# Altium schematic sheet [00] - COVER PAGE.SchDoc
size A3; DocumentNumber: 2; SheetNumber: 2; SheetTotal: 5
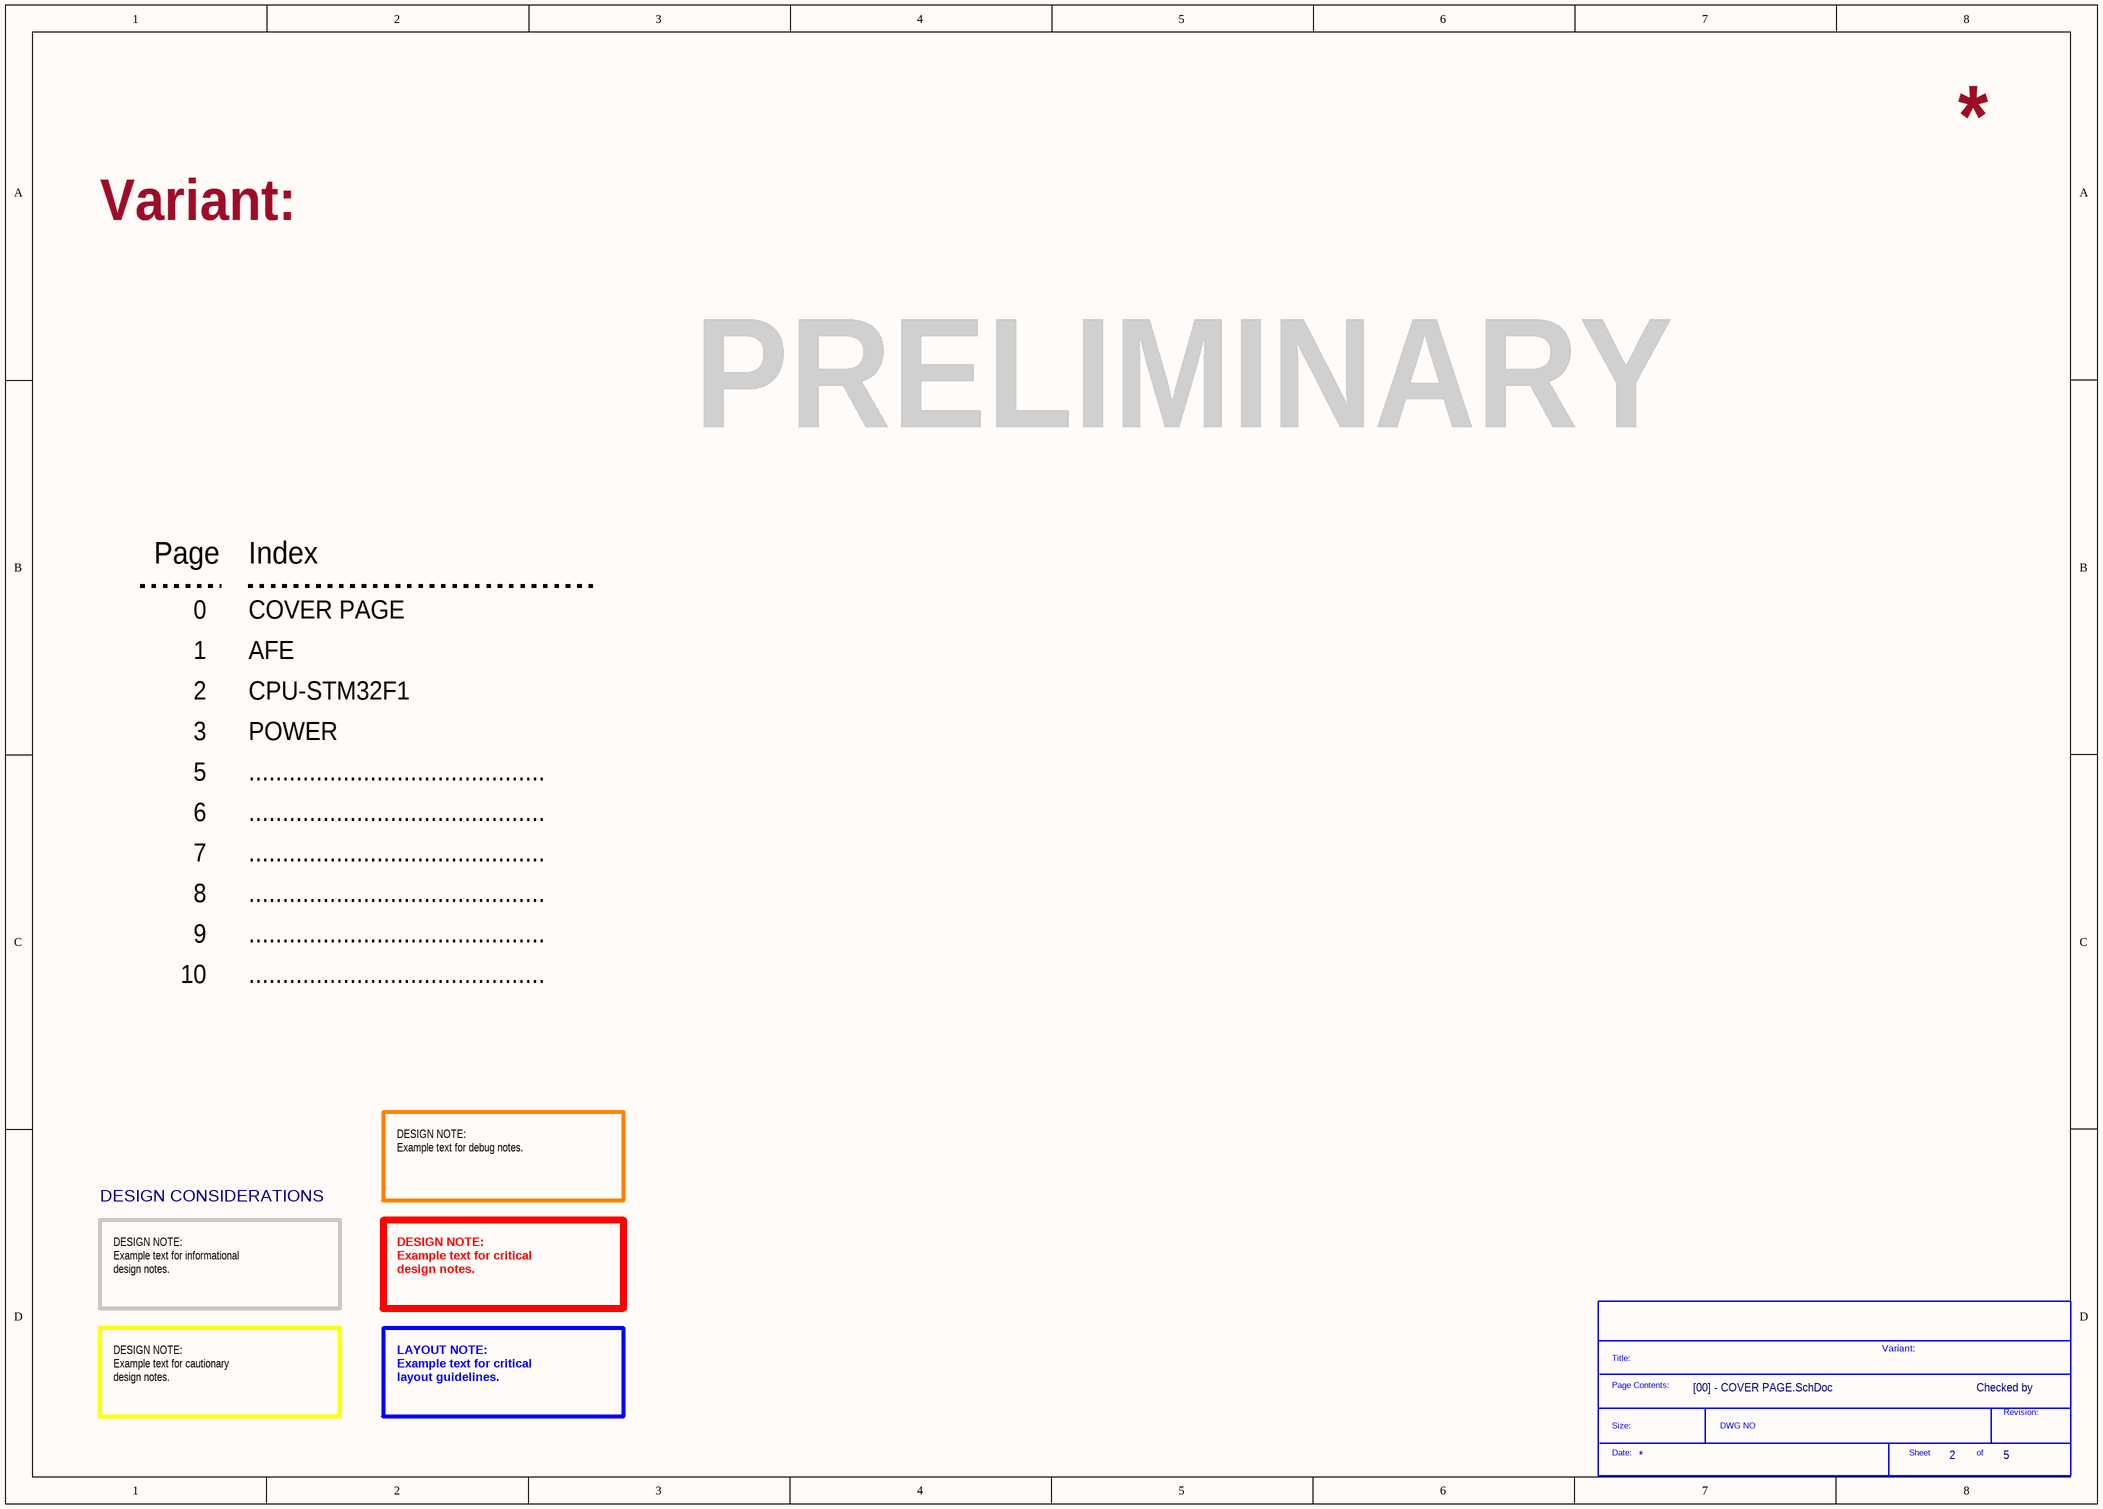
[diagram p0: [00] - COVER PAGE.SchDoc]

## Parts
*  SDTitleBlock  (value not drawn)  (graphical)

## Notes on the sheet
- Variant:
- PRELIMINARY
- Page
- Index
- 0
- COVER PAGE
- 1
- 2
- AFE
- CPU-STM32F1
- 3
- 5
- POWER
- ............................................
- 6
- 7
- 8
- 9
- 10
- DESIGN NOTE:
  Example text for debug notes.
- DESIGN CONSIDERATIONS
- DESIGN NOTE:
  Example text for informational
  design notes.
- DESIGN NOTE:
  Example text for critical
  design notes.
- Checked by
- DESIGN NOTE:
  Example text for cautionary
  design notes.
- LAYOUT NOTE:
  Example text for critical
  layout guidelines.
- (in symbol SDTitleBlock) Title:; Page Contents:; Revision:; Size:; DWG NO; Date:; Sheet; of